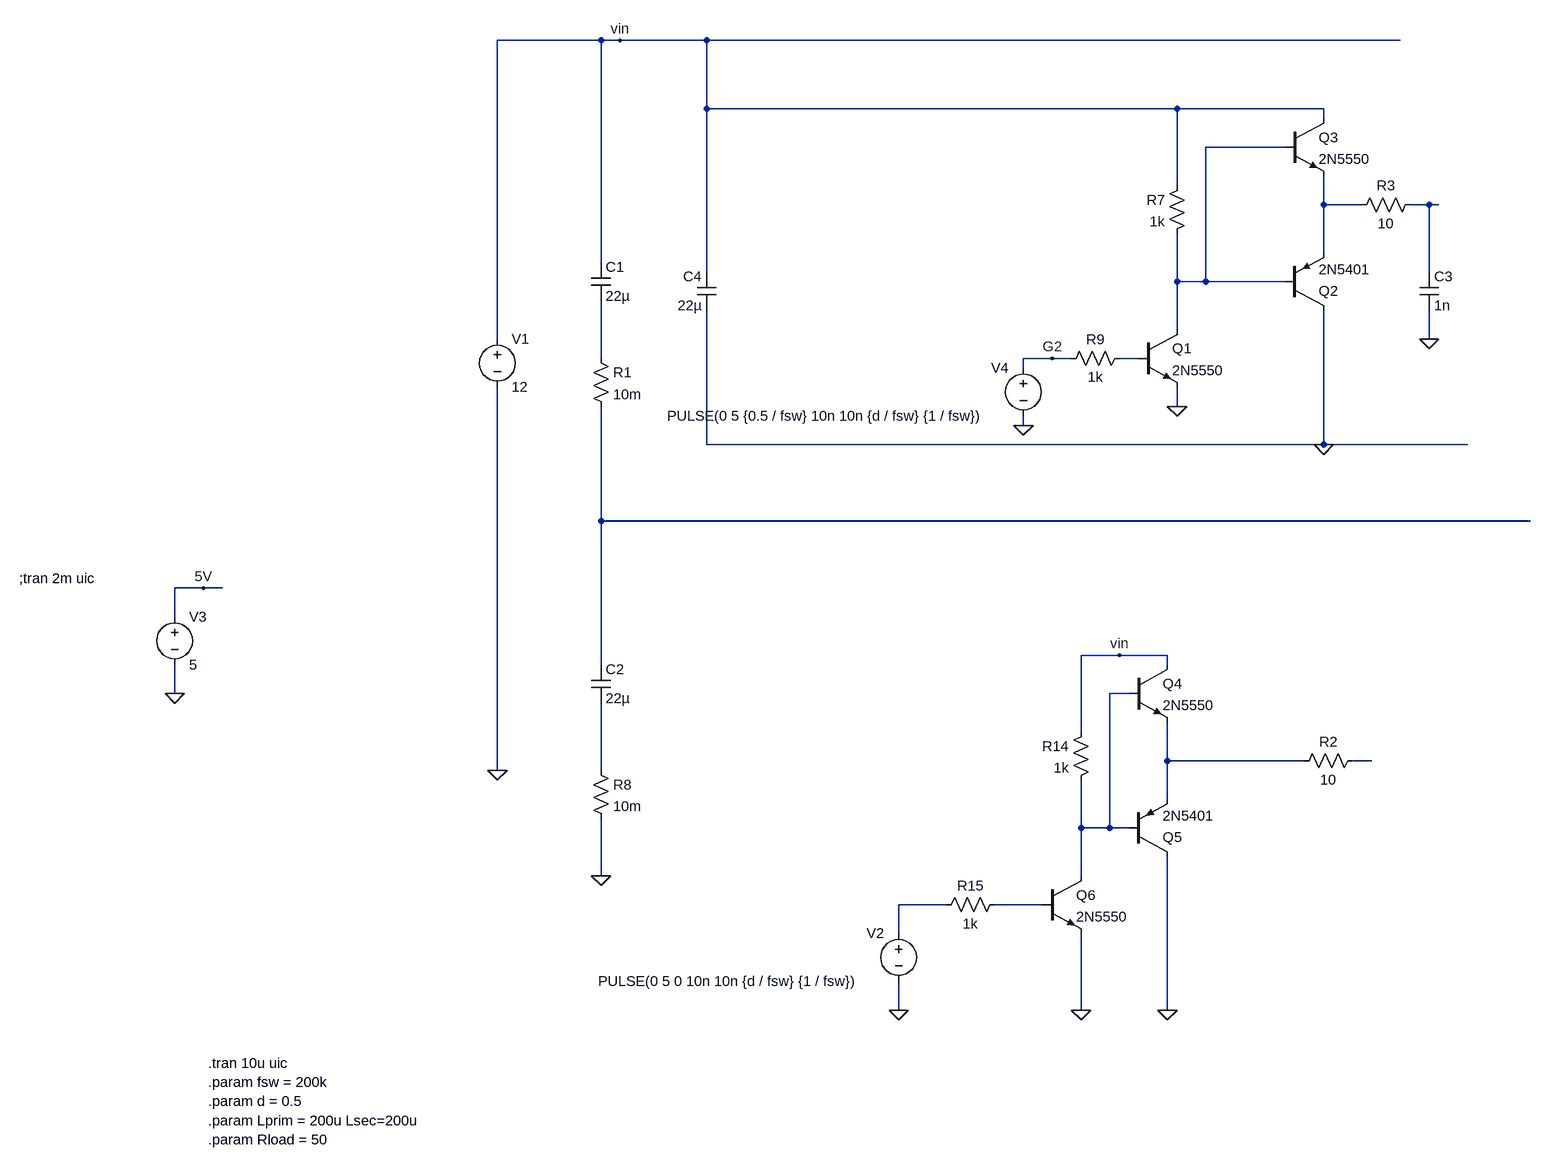
[diagram p0: schematic gate_drive_v2.asc]
gate_drive_v2.asc, the LTspice schematic file:
Version 4
SHEET 1 11460 3748
WIRE -176 -272 -432 -272
WIRE -144 -272 -176 -272
WIRE 0 -272 -144 -272
WIRE 1168 -272 0 -272
WIRE 0 -96 0 -272
WIRE 784 -96 0 -96
WIRE 1040 -96 784 -96
WIRE 1040 -80 1040 -96
WIRE 976 -32 832 -32
WIRE 784 32 784 -96
WIRE 1040 64 1040 16
WIRE 1104 64 1040 64
WIRE 1216 64 1184 64
WIRE 1232 64 1216 64
WIRE 1040 144 1040 64
WIRE -176 160 -176 -272
WIRE 0 176 0 -96
WIRE 1216 176 1216 64
WIRE 784 192 784 112
WIRE 832 192 832 -32
WIRE 832 192 784 192
WIRE 976 192 832 192
WIRE 784 272 784 192
WIRE -432 288 -432 -272
WIRE 1216 288 1216 240
WIRE -176 320 -176 224
WIRE 576 320 528 320
WIRE 608 320 576 320
WIRE 720 320 688 320
WIRE 528 336 528 320
WIRE 784 400 784 368
WIRE 528 432 528 416
WIRE 0 464 0 240
WIRE 1040 464 1040 240
WIRE 1040 464 0 464
WIRE 1280 464 1040 464
WIRE -176 656 -176 400
WIRE 1504 656 -176 656
WIRE -1552 768 -1600 768
WIRE -1520 768 -1552 768
WIRE -1600 816 -1600 768
WIRE 688 880 624 880
WIRE 768 880 688 880
WIRE -176 896 -176 656
WIRE 768 896 768 880
WIRE -1600 944 -1600 896
WIRE 704 944 672 944
WIRE 624 1008 624 880
WIRE 768 1056 768 992
WIRE 1008 1056 768 1056
WIRE 1120 1056 1088 1056
WIRE -432 1072 -432 368
WIRE -176 1072 -176 960
WIRE 768 1120 768 1056
WIRE 624 1168 624 1088
WIRE 672 1168 672 944
WIRE 672 1168 624 1168
WIRE 704 1168 672 1168
WIRE -176 1248 -176 1152
WIRE 624 1248 624 1168
WIRE 400 1296 320 1296
WIRE 560 1296 480 1296
WIRE 320 1344 320 1296
WIRE 320 1472 320 1424
WIRE 624 1472 624 1344
WIRE 768 1472 768 1216
FLAG 320 1472 0
FLAG -432 1072 0
FLAG 576 320 G2
FLAG -176 1248 0
FLAG 784 400 0
FLAG -1600 944 0
FLAG -1552 768 5V
FLAG 528 432 0
FLAG -144 -272 vin
FLAG 624 1472 0
FLAG 768 1472 0
FLAG 688 880 vin
FLAG 1040 464 0
FLAG 1216 288 0
SYMBOL res 1104 1040 R90
WINDOW 0 0 56 VBottom 2
WINDOW 3 32 56 VTop 2
SYMATTR InstName R2
SYMATTR Value 10
SYMBOL voltage -432 272 R0
WINDOW 123 0 0 Left 0
WINDOW 39 0 0 Left 0
SYMATTR InstName V1
SYMATTR Value 12
SYMBOL res 1200 48 R90
WINDOW 0 0 56 VBottom 2
WINDOW 3 32 56 VTop 2
SYMATTR InstName R3
SYMATTR Value 10
SYMBOL voltage 320 1328 M0
WINDOW 123 0 0 Left 0
WINDOW 39 0 0 Left 0
WINDOW 3 72 96 Left 2
SYMATTR Value PULSE(0 5 0 10n 10n {d / fsw} {1 / fsw})
SYMATTR InstName V2
SYMBOL res -192 304 R0
SYMATTR InstName R1
SYMATTR Value 10m
SYMBOL res -192 1056 R0
SYMATTR InstName R8
SYMATTR Value 10m
SYMBOL cap -192 160 R0
SYMATTR InstName C1
SYMATTR Value 22µ
SYMBOL cap -192 896 R0
SYMATTR InstName C2
SYMATTR Value 22µ
SYMBOL cap 16 176 M0
SYMATTR InstName C4
SYMATTR Value 22µ
SYMBOL res 800 16 M0
SYMATTR InstName R7
SYMATTR Value 1k
SYMBOL pnp 976 240 M180
SYMATTR InstName Q2
SYMATTR Value 2N5401
SYMBOL res 704 304 R90
WINDOW 0 0 56 VBottom 2
WINDOW 3 32 56 VTop 2
SYMATTR InstName R9
SYMATTR Value 1k
SYMBOL voltage -1600 800 R0
WINDOW 123 0 0 Left 0
WINDOW 39 0 0 Left 0
SYMATTR InstName V3
SYMATTR Value 5
SYMBOL voltage 528 320 M0
WINDOW 123 0 0 Left 0
WINDOW 39 0 0 Left 0
WINDOW 3 72 96 Left 2
SYMATTR Value PULSE(0 5 {0.5 / fsw} 10n 10n {d / fsw} {1 / fsw})
SYMATTR InstName V4
SYMBOL res 640 992 M0
SYMATTR InstName R14
SYMATTR Value 1k
SYMBOL npn 704 896 R0
SYMATTR InstName Q4
SYMATTR Value 2N5550
SYMBOL pnp 704 1216 M180
SYMATTR InstName Q5
SYMATTR Value 2N5401
SYMBOL npn 720 272 R0
SYMATTR InstName Q1
SYMATTR Value 2N5550
SYMBOL npn 976 -80 R0
SYMATTR InstName Q3
SYMATTR Value 2N5550
SYMBOL npn 560 1248 R0
SYMATTR InstName Q6
SYMATTR Value 2N5550
SYMBOL res 496 1280 R90
WINDOW 0 0 56 VBottom 2
WINDOW 3 32 56 VTop 2
SYMATTR InstName R15
SYMATTR Value 1k
SYMBOL cap 1200 176 R0
SYMATTR InstName C3
SYMATTR Value 1n
TEXT -1544 1560 Left 2 !.tran 10u uic
TEXT -1544 1592 Left 2 !.param fsw = 200k
TEXT -1544 1624 Left 2 !.param d = 0.5
TEXT -1544 1688 Left 2 !.param Rload = 50
TEXT -1544 1656 Left 2 !.param Lprim = 200u Lsec=200u
TEXT -3264 752 Left 2 !;tran 2m uic

The netlist it stands for:
* gate_drive_v2.asc
R2 N009 N008 10
V1 vin 0 12
R3 N003 N002 10
V2 N011 0 PULSE(0 5 0 10n 10n {d / fsw} {1 / fsw})
R1 N004 N006 10m
R8 N010 0 10m
C1 vin N004 22µ
C2 N006 N010 22µ
C4 vin 0 22µ
R7 vin N001 1k
Q2 0 N001 N002 0 2N5401
R9 N005 G2 1k
V3 5V 0 5
V4 G2 0 PULSE(0 5 {0.5 / fsw} 10n 10n {d / fsw} {1 / fsw})
R14 vin N007 1k
Q4 vin N007 N008 0 2N5550
Q5 0 N007 N008 0 2N5401
Q1 N001 N005 0 0 2N5550
Q3 vin N001 N002 0 2N5550
Q6 N007 N012 0 0 2N5550
R15 N012 N011 1k
C3 N003 0 1n
.model NPN NPN
.model PNP PNP
.lib standard.bjt
.tran 10u uic
.param fsw = 200k
.param d = 0.5
.param Rload = 50
.param Lprim = 200u Lsec=200u
;tran 2m uic
.backanno
.end